# EAGLE design BEP3_RPM (EAGLE 6.4)
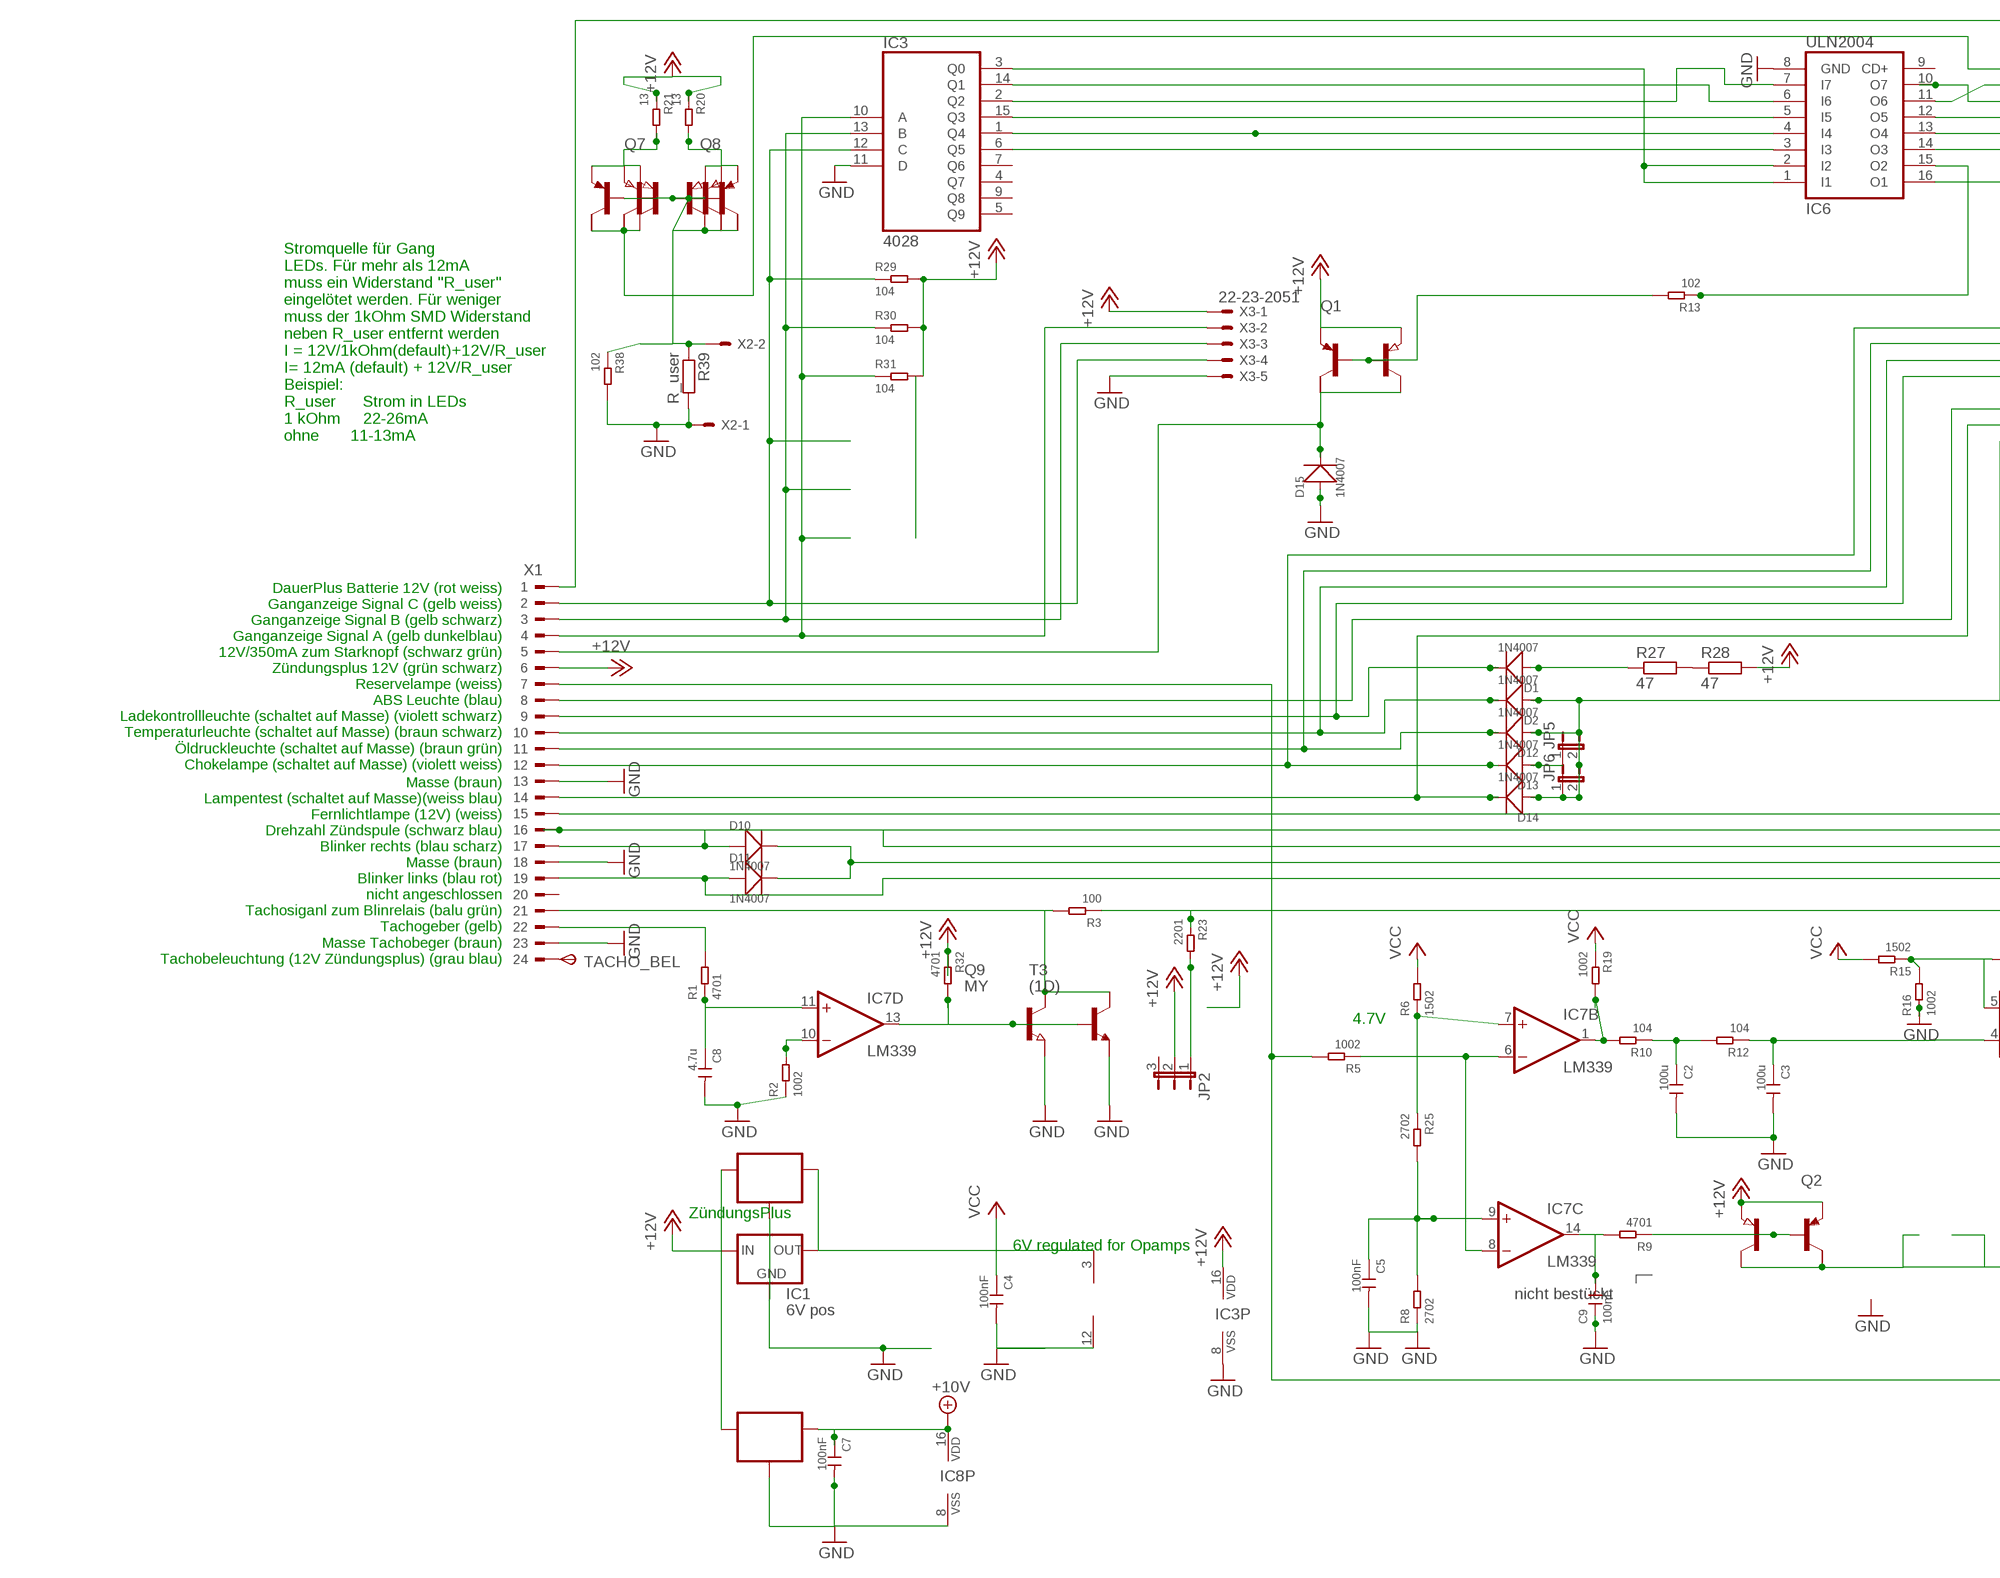
[diagram p0: schematic, sheet 1, part 1 of 2]
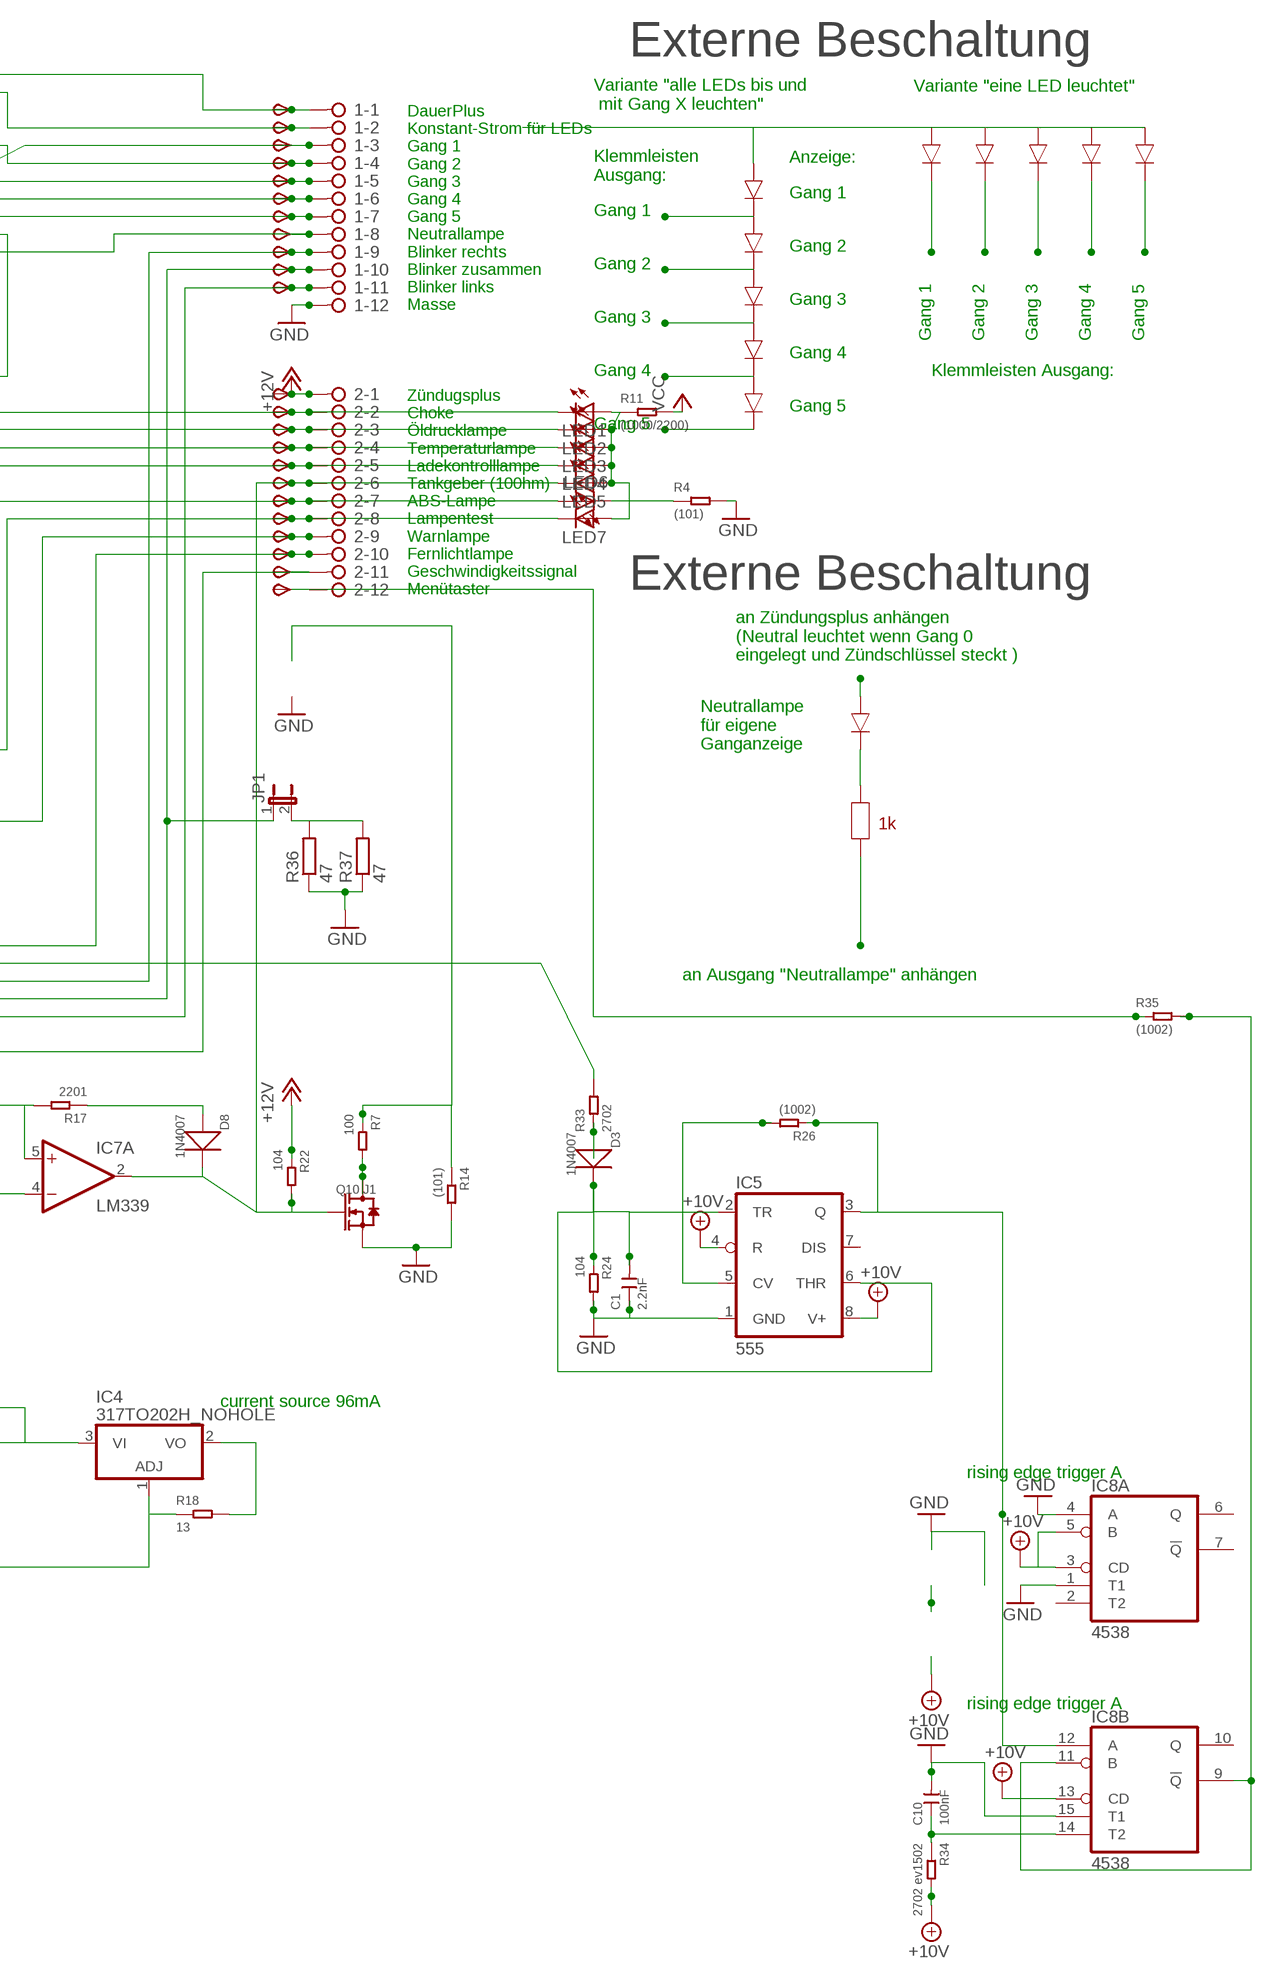
[diagram p1: schematic, sheet 1, part 2 of 2]

## Parts
1  2081-1132  [12-PIN]
2  2081-1132  [12-PIN]
C1  2.2nF  CERAMIC-100NF-50V-10%-X7R(0805)  [C0805]
C2  100u  CERAMIC-100UF-6.3V-20%-X5R(1206)  [C1206]
C3  100u  CERAMIC-100UF-6.3V-20%-X5R(1206)  [C1206]
C4  100nF  CERAMIC-100NF-50V-10%-X7R(0805)  [C0805]
C5  100nF  CERAMIC-100NF-50V-10%-X7R(0805)  [C0805]
C7  100nF  CERAMIC-100NF-50V-10%-X7R(0805)  [C0805]
C8  4.7u  CERAMIC-4.7UF-25V-10%-X5R(0805)  [C0805]
C9  100nF  CERAMIC-100NF-50V-10%-X7R(0805)  [C0805]
C10  100nF  CERAMIC-100NF-50V-10%-X7R(0805)  [C0805]
D1  1N4007  DIODE-GEN-PURPOSE-1KV-1A(DO-214AC)  [DO-214AC]
D2  1N4007  DIODE-GEN-PURPOSE-1KV-1A(DO-214AC)DO-214AC/1206  [DO-214AC-1206MOUNT]
D3  1N4007  DIODE-GEN-PURPOSE-1KV-1A(DO-214AC)  [DO-214AC]
D8  1N4007  DIODE-GEN-PURPOSE-1KV-1A(DO-214AC)DO-214AC/1206  [DO-214AC-1206MOUNT]
D10  1N4007  DIODE-GEN-PURPOSE-1KV-1A(DO-214AC)  [DO-214AC]
D11  1N4007  DIODE-GEN-PURPOSE-1KV-1A(DO-214AC)  [DO-214AC]
D12  1N4007  DIODE-GEN-PURPOSE-1KV-1A(DO-214AC)DO-214AC/1206  [DO-214AC-1206MOUNT]
D13  1N4007  DIODE-GEN-PURPOSE-1KV-1A(DO-214AC)DO-214AC/1206  [DO-214AC-1206MOUNT]
D14  1N4007  DIODE-GEN-PURPOSE-1KV-1A(DO-214AC)DO-214AC/1206  [DO-214AC-1206MOUNT]
D15  1N4007  DIODE-GEN-PURPOSE-1KV-1A(DO-214AC)  [DO-214AC]
IC1  6V pos  78LXX  [78LXX]
IC2  78LXX-SOT89  [SOT89]
IC3  4028  4028D  [SO16]
IC4  317TO202H_NOHOLE  [TO220H_NOHOLE]
IC5  555  NE555D  [SO08]
IC6  ULN2004  ULN2004AD  [SO16]
IC7  LM339  LM339D  [SO14]
IC8  4538  4538D  [SO16]
IC9  78LXX-SOT89  [SOT89]
JP1  JP1E  [JP1]
JP2  JP2E  [JP2]
JP5  JP1E  [JP1]
JP6  JP1E  [JP1]
LED1  LEDLD260  [LD260]
LED2  LEDLD260  [LD260]
LED3  LEDLD260  [LD260]
LED4  LEDLD260  [LD260]
LED5  LEDLD260  [LD260]
LED6  LEDLD260  [LD260]
LED7  LEDLD260  [LD260]
Q1  PNP-TRANSISTOR_SOT89  [SOT89]
Q2  PNP-TRANSISTOR_SOT89  [SOT89]
Q3  AH-16  BCP53T1  [SOT223]
Q4  (AH-16)  BCP53T1  [SOT223]
Q5  (AH-16)  BCP53T1  [SOT223]
Q6  (AH-16)  BCP53T1  [SOT223]
Q7  PNP-TRANSISTOR_SOT89  [SOT89]
Q8  PNP-TRANSISTOR_SOT89  [SOT89]
Q9  MY  NPN-TRANSISTOR_SOT89  [SOT89]
Q10  J1  SMD-MOSFET-N-CH-50V-200MA-BSS138W-7-F(SOT-23)  [SOT-23]
R1  4701  SMD-RES-4.7K-5%-1/8W(0805)  [R0805]
R2  1002  SMD-RES-10K-1%-1/8W(0805)  [R0805]
R3  100  SMD-RES-220R-5%-1/8W(0805)  [R0805]
R4  (101)  SMD-RES-100R-5%-1/8W(0805)  [R0805]
R5  1002  SMD-RES-10K-1%-1/8W(0805)  [R0805]
R6  1502  SMD-RES-10K-1%-1/8W(0805)  [R0805]
R7  100  SMD-RES-2.2K-5%-1/8W(0805)  [R0805]
R8  2702  SMD-RES-4.7K-5%-1/8W(0805)  [R0805]
R9  4701  SMD-RES-4.7K-5%-1/8W(0805)  [R0805]
R10  104  SMD-RES-10K-1%-1/8W(0805)  [R0805]
R11  (1000/2200)  SMD-RES-100R-5%-1/8W(0805)  [R0805]
R12  104  SMD-RES-10K-1%-1/8W(0805)  [R0805]
R13  102  SMD-RES-1K-5%-1/8W(0805)  [R0805]
R14  (101)  SMD-RES-2.2K-5%-1/8W(0805)  [R0805]
R15  1502  SMD-RES-10K-1%-1/8W(0805)  [R0805]
R16  1002  SMD-RES-10K-1%-1/8W(0805)  [R0805]
R17  2201  SMD-RES-2.2K-5%-1/8W(0805)  [R0805]
R18  13  SMD-RES-13R-5%-1/4W(1206)  [R1206]
R19  1002  SMD-RES-10K-1%-1/8W(0805)  [R0805]
R20  13  SMD-RES-13R-5%-1/4W(1206)  [R1206]
R21  13  SMD-RES-13R-5%-1/4W(1206)  [R1206]
R22  104  SMD-RES-10K-1%-1/8W(0805)  [R0805]
R23  2201  SMD-RES-2.2K-5%-1/8W(0805)  [R0805]
R24  104  SMD-RES-10K-1%-1/8W(0805)  [R0805]
R25  2702  SMD-RES-4.7K-5%-1/8W(0805)  [R0805]
R26  (1002)  SMD-RES-10K-1%-1/8W(0805)  [R0805]
R27  47  R-EU_V235/17_1MM  [V235/17_1MM]
R28  47  R-EU_V235/17_1MM  [V235/17_1MM]
R29  104  SMD-RES-10K-1%-1/8W(0805)  [R0805]
R30  104  SMD-RES-10K-1%-1/8W(0805)  [R0805]
R31  104  SMD-RES-10K-1%-1/8W(0805)  [R0805]
R32  4701  SMD-RES-4.7K-5%-1/8W(0805)  [R0805]
R33  2702  SMD-RES-10K-1%-1/8W(0805)  [R0805]
R34  2702 ev1502  SMD-RES-4.7K-5%-1/8W(0805)  [R0805]
R35  (1002)  SMD-RES-4.7K-5%-1/8W(0805)  [R0805]
R36  47  R-EU_V235/17_1MM  [V235/17_1MM]
R37  47  R-EU_V235/17_1MM  [V235/17_1MM]
R38  102  SMD-RES-1K-5%-1/8W(0805)  [R0805]
R39  R_user  R-EU_R0805  [R0805]
T1  PNP2SM8  [SM8]
T3  (1D)  MMBTA42LT1-NPN-SOT23-BEC  [SOT23-BEC]
TACHO_BEL  TPSP1_1MM  [P1_1.0MM]
TP1  TPSB1.8  [B1.8]
TP2  TPSB1.8  [B1.8]
TP3  TPSB1.8  [B1.8]
TP4  TPSB1.8  [B1.8]
TP5  TPSB1.8  [B1.8]
TP6  TPSB1.8  [B1.8]
TP7  TPSB1.8  [B1.8]
TP8  TPSB1.8  [B1.8]
TP9  TPSB1.8  [B1.8]
TP10  TPSB1.8  [B1.8]
TP11  TPSB1.8  [B1.8]
TP12  TPSB1.8  [B1.8]
TP13  TPSB1,27  [B1,27]
TP16  TPSB1.8  [B1.8]
TP17  TPSB1.8  [B1.8]
TP18  TPSB1.8  [B1.8]
TP19  TPSB1.8  [B1.8]
TP21  TPSB1.8  [B1.8]
TP22  TPSB1.8  [B1.8]
TP23  TPSB1.8  [B1.8]
TP24  TPSB1,27  [B1,27]
TP25  TPSB1.8  [B1.8]
TP26  TPSB1.8  [B1.8]
X1  CON_BMWV2  [24-PIN_V2]
X2  22-23-2021  [22-23-2021]
X3  22-23-2051  [22-23-2051]

## Nets
+10V: C7.1 IC5.4(R) IC5.8(V+) IC8.3(A:CD) IC8.5(A:B) IC8.13(B:CD) IC8.16(P:VDD) IC9.1(OUT) R34.2
+12V: 2.1 IC1.IN IC2.3(IN) IC3.16(VDD) IC9.3(IN) JP2.2 Q1.3(E) Q2.3(E) Q3.3(E) Q4.3(E) R20.1 R21.1 R22.1 R28.2 R29.2 R30.2 R31.2 R32.1 TP12.TP(PP) X1.6 X3.1
GND: 1.12 C1.1 C2.2 C3.2 C4.2 C5.2 C7.2 C8.2 C9.1 C10.2 D15.1(+) IC1.GND IC2.2(GND) IC2.4(GND) IC3.8(VSS) IC3.11(D) IC5.1(GND) IC6.8(GND) IC7.12(P:GND) IC8.1(A:T1) IC8.4(A:A) IC8.8(P:VSS) IC8.15(B:T1) Q9.3(E) Q10.2(S) R2.1 R4.2 R8.1 R14.2 R16.1 R24.2 R36.1 R37.1 R38.2 R39.2 T3.E X1.13 X1.18 X1.23 X2.1 X3.5
N$1: 2.9 D2.1(+) D12.1(+) D14.1(+) JP5.2 JP6.1 JP6.2 TP24.TP(PP)
N$2: IC3.10(A) R31.1 X1.4 X3.2
N$3: IC3.13(B) R30.1 X1.3 X3.3
N$4: 2.7 LED6.A TP22.TP(PP) X1.8
N$5: Q5.3(E) Q8.3(E) R21.2 T1.1(B:E)
N$7: IC7.10(D:-IN) R2.2
N$8: R27.2 R28.1
N$9: Q6.3(E) Q7.3(E) R20.2 T1.3(A:E)
N$11: D15.2(-) Q1.2(C) Q3.2(C) X1.5
N$12: 2.2 D13.2(-) LED1.K(C) TP16.TP(PP) X1.12
N$13: 2.3 D12.2(-) LED2.K(C) TP17.TP(PP) X1.11
N$14: 2.4 D2.2(-) LED3.K(C) TP18.TP(PP) X1.10
N$15: IC4.3(VI) Q2.2(C) Q4.2(C)
N$16: IC7.6(B:-IN) IC7.8(C:-IN) R5.1
N$17: IC3.12(C) R29.1 X1.2 X3.4
N$18: IC3.15(Q3) IC6.5(I5)
N$19: 2.8 D14.2(-) LED7.K(C) TP23.TP(PP) X1.14
N$20: 1.9 D10.1(+) TP9.TP(PP) X1.17
N$21: 1.11 D11.1(+) TP11.TP(PP) X1.19
N$22: IC8.9(B:!Q) IC8.11(B:B) R35.2
N$23: R1.2 X1.22
N$24: C8.1 IC7.11(D:+IN) R1.1
N$25: 1.6 IC6.13(O4) TP6.TP(PP)
N$26: 1.7 IC6.14(O3) TP7.TP(PP)
N$27: 2.11 R3.1 R23.1 TP26.TP(PP)
N$28: R7.1 R14.1
N$29: JP2.1 R23.2
N$30: C5.1 IC7.9(C:+IN) R8.2 R25.2
N$31: C9.2 IC7.14(C:OUT) R9.2
N$32: C1.2 D3.2(-) IC5.2(TR) IC5.6(THR) R24.1
N$34: LED6.K(C) R4.1
N$35: IC4.1(ADJ) R5.2 R18.1 X1.7
N$36: Q2.1(B) Q4.1(B) R9.1
N$37: IC3.2(Q2) IC6.7(I7)
N$38: 1.3 IC6.11(O6) TP3.TP(PP)
N$39: 1.5 IC6.12(O5) TP5.TP(PP)
N$41: LED1.A LED2.A LED3.A LED4.A LED5.A LED7.A R11.1
N$42: R33.2 X1.16
N$43: Q1.1(B) Q3.1(B) R13.2
N$44: IC3.3(Q0) IC6.1(I1) IC6.2(I2)
N$45: C2.1 R10.1 R12.2
N$46: C3.1 IC7.4(A:-IN) R12.1
N$47: IC7.5(A:+IN) R15.1 R16.2 R17.2
N$48: Q10.3(D) R7.2
N$49: D8.1(+) R17.1
N$50: IC3.1(Q4) IC6.4(I4)
N$52: 1.8 IC6.16(O1) TP8.TP(PP)
N$53: 2.10 TP25.TP(PP) X1.15
N$54: D1.1(+) R27.1
N$55: 2.5 D1.2(-) LED4.K(C) TP19.TP(PP) X1.9
N$56: IC3.14(Q1) IC6.6(I6)
N$57: Q5.1(B) Q6.1(B) Q6.2(C) Q7.1(B) Q7.2(C) Q8.1(B) R38.1 R39.1 T1.2(B:B) T1.4(A:B) T1.6(A:C1) X2.2
N$58: TACHO_BEL.TP(PP) X1.24
N$59: 1.2 Q5.2(C) Q8.2(C) T1.8(B:C1) TP2.TP(PP)
N$60: 2.6 D8.2(-) IC7.2(A:OUT) LED5.K(C) Q10.1(G) R22.2 TP21.TP(PP)
N$61: IC3.6(Q5) IC6.3(I3)
N$64: IC4.2(VO) R18.2
N$65: IC5.5(CV) R26.2
N$67: 1.4 IC6.10(O7) TP4.TP(PP)
N$69: 1.1 TP1.TP(PP) X1.1
N$83: IC7.7(B:+IN) R6.1 R25.1
N$84: Q9.2(C) R3.2 T3.C X1.21
N$85: IC7.13(D:OUT) Q9.1(B) R32.2 T3.B
N$86: IC5.3(Q) IC8.12(B:A) R26.1
N$87: D3.1(+) R33.1
N$88: IC6.15(O2) R13.1
N$89: C10.1 IC8.14(B:T2) R34.1
N$90: 2.12 R35.1 TP13.TP(PP)
N$93: 1.10 D10.2(-) D11.2(-) JP1.1 TP10.TP(PP)
N$94: JP1.2 R36.2 R37.2
N$95: D13.1(+) JP5.1
N$580: IC7.1(B:OUT) R10.2 R19.2
VCC: C4.1 IC1.OUT IC2.1(OUT) IC7.3(P:V+) R6.2 R11.2 R15.2 R19.1
Unconnected: IC3.4(Q7) IC3.5(Q9) IC3.7(Q6) IC3.9(Q8) IC5.7(DIS) IC6.9(CD+) IC8.2(A:T2) IC8.6(A:Q) IC8.7(A:!Q) IC8.10(B:Q) IC9.2(GND) IC9.4(GND) JP2.3 Q3.4(C/) Q4.4(C/) Q5.4(C/) Q6.4(C/) T1.5(A:C) T1.7(B:C) X1.20

## Notes on the sheet
- Externe Beschaltung
- Variante "eine LED leuchtet"
- Variante "alle LEDs bis und
   mit Gang X leuchten"
- Anzeige:
- Klemmleisten
  Ausgang:
- Gang 1
- DauerPlus
  Konstant-Strom für LEDs
  Gang 1
  Gang 2
  Gang 3
  Gang 4
  Gang 5
  Neutrallampe
  Blinker rechts
  Blinker zusammen
  Blinker links
  Masse
- Gang 1
- Gang 2
- Gang 2
- Gang 3
- Gang 3
- Gang 1 | Gang 2 | Gang 3 | Gang 4 | Gang 5
- Gang 4
- Gang 4 | Klemmleisten Ausgang:
- Gang 5
- Gang 5
- Zündugsplus
  Choke
  Öldrucklampe
  Temperaturlampe
  Ladekontrolllampe
  Tankgeber (100hm)
  ABS-Lampe
  Lampentest
  Warnlampe
  Fernlichtlampe
  Geschwindigkeitssignal
  Menütaster
- Stromquelle für Gang
  LEDs. Für mehr als 12mA
  muss ein Widerstand "R_user"
  eingelötet werden. Für weniger
  muss der 1kOhm SMD Widerstand
  neben R_user entfernt werden
  I = 12V/1kOhm(default)+12V/R_user
  I= 12mA (default) + 12V/R_user
  Beispiel:
  R_user      Strom in LEDs
  1 kOhm     22-26mA
  ohne       11-13mA
- Externe Beschaltung
- an Zündungsplus anhängen
  (Neutral leuchtet wenn Gang 0
  eingelegt und Zündschlüssel steckt )
- Neutrallampe
  für eigene
  Ganganzeige
- DauerPlus Batterie 12V (rot weiss)
  Ganganzeige Signal C (gelb weiss)
  Ganganzeige Signal B (gelb schwarz)
  Ganganzeige Signal A (gelb dunkelblau)
  12V/350mA zum Starknopf (schwarz grün)
  Zündungsplus 12V (grün schwarz)
  Reservelampe (weiss)
  ABS Leuchte (blau)
  Ladekontrollleuchte (schaltet auf Masse) (violett schwarz)
  Temperaturleuchte (schaltet auf Masse) (braun schwarz)
  Öldruckleuchte (schaltet auf Masse) (braun grün)
  Chokelampe (schaltet auf Masse) (violett weiss)
- 1k
- an Ausgang "Neutrallampe" anhängen
- Masse (braun)
  Lampentest (schaltet auf Masse)(weiss blau)
  Fernlichtlampe (12V) (weiss)
  Drehzahl Zündspule (schwarz blau)
  Blinker rechts (blau scharz)
  Masse (braun)
  Blinker links (blau rot)
  nicht angeschlossen
  Tachosiganl zum Blinrelais (balu grün)
  Tachogeber (gelb)
  Masse Tachobeger (braun)
  Tachobeleuchtung (12V Zündungsplus) (grau blau)
- 4.7V
- ZündungsPlus
- current source 96mA
- 6V regulated for Opamps
- nicht bestückt | rising edge trigger A
- rising edge trigger A

## Library data of the parts
1 2 = con WAGO BMW:2081-1132: WAGO SREW CLAMP
C1 C4 C5 C7 C9 C10 = Seeed-Capacitor-2016:CERAMIC-100NF-50V-10%-X7R(0805): 302010165; MPN: CC0805KRX7R9BB104; VALUE: 100nf
C2 C3 = Seeed-Capacitor-2016:CERAMIC-100UF-6.3V-20%-X5R(1206): 302010183; MPN: GRM31CR60J107ME39L; VALUE: 100uf
C8 = Seeed-Capacitor-2016:CERAMIC-4.7UF-25V-10%-X5R(0805): 302010146; MPN: CC0805KKX5R8BB475; VALUE: 4.7uf
D1 D3 D10 D11 D15 = Diode-do214ac:DIODE-GEN-PURPOSE-1KV-1A(DO-214AC): 304010013; MPN: 1N4007
D2 D8 D12-D14 = Diode-do214ac:DIODE-GEN-PURPOSE-1KV-1A(DO-214AC): 304010013
IC1 = v-reg:78LXX: VOLTAGE REGULATOR
IC2 IC9 = 78LXX:78LXX
IC3 = 4028:4028: BCD to decimal DECODER
IC4 = linear_BMW:*317: Positive VOLTAGE REGULATOR
IC5 = linear:*555: TIMER
IC6 = uln-udn:ULN2004A: DRIVER ARRAY
IC7 = LM339:LM339: Low Power Low Offset Voltage Quad Comparators with open collector; LM139/LM239/LM339/LM2901/LM3302
IC8 = 45xx:4538: Dual precision monostable MULTIVIBRATOR
JP1 JP5 JP6 = jumper:JP1E: JUMPER
JP2 = jumper:JP2E: JUMPER
LED1-LED7 = led:LED: LED OSRAM: - CHIPLED LG R971, LG N971, LY N971, LG Q971, LY Q971, LO R971, LY R971 LH N974, LH R974 LS Q976, LO Q976, LY Q976 LO Q996 - Hyper CHIPLED LW Q18S LB Q993, LB Q99A, LB R99A - SideLED LS A670, LO A670, LY A670, LG A670, LP A670 LB A673, LV A673, LT A673, LW A673 LH A674 LY A675 LS A676, LA A676, LO A676, LY A676, LW A676 LS A679, LY A679, LG A679 - Hyper Micro SIDELED® LS Y876, LA Y876, LO Y876, LY Y876 LT Y87S - SmartLED LW L88C, LW L88S LB L89C, LB L89S, LG L890 LS L89K, LO L89K, LY L89K LS L896, LA L896, LO L896, LY L896 - TOPLED LS T670, LO T670, LY T670, LG T670, LP T670 LSG T670, LSP T670, LSY T670, LOP T670, LYG T670 LG T671, LOG T671, LSG T671 LB T673, LV T673, LT T673, LW T673 LH T674 LS T676, LA T676, LO T676, LY T676, LB T676, LH T676, LSB T676, LW T676 LB T67C, LV T67C, LT T67C, LS T67K, LO T67K, LY T67K, LW E67C LS E67B, LA E67B, LO E67B, LY E67B, LB E67C, LV E67C, LT E67C LW T67C LS T679, LY T679, LG T679 LS T770, LO T770, LY T770, LG T770, LP T770 LB T773, LV T773, LT T773, LW T773 LH T774 LS E675, LA E675, LY E675, LS T675 LS T776, LA T776, LO T776, LY T776, LB T776 LHGB T686 LT T68C, LB T68C - Hyper Mini TOPLED® LB M676 - Mini TOPLED Santana® LG M470 LS M47K, LO M47K, LY M47K Source: http://www.osram.convergy.de LUXEON: - LUMILED® LXK2-PW12-R00, LXK2-PW12-S00, LXK2-PW14-U00, LXK2-PW14-V00 LXK2-PM12-R00, LXK2-PM12-S00, LXK2-PM14-U00 LXK2-PE12-Q00, LXK2-PE12-R00, LXK2-PE12-S00, LXK2-PE14-T00, LXK2-PE14-U00 LXK2-PB12-K00, LXK2-PB12-L00, LXK2-PB12-M00, LXK2-PB14-N00, LXK2-PB14-P00, LXK2-PB14-Q00 LXK2-PR12-L00, LXK2-PR12-M00, LXK2-PR14-Q00, LXK2-PR14-R00 LXK2-PD12-Q00, LXK2-PD12-R00, LXK2-PD12-S00 LXK2-PH12-R00, LXK2-PH12-S00 LXK2-PL12-P00, LXK2-PL12-Q00, LXK2-PL12-R00 Source: www.luxeon.com KINGBRIGHT: KA-3528ASYC Source: www.kingbright.com
Q1 Q2 Q7 Q8 = Transistor_SOT89:PNP-TRANSISTOR_: PNP TRANSISTOR
Q3-Q6 = BCP53_:BCP53*
Q9 = Transistor_SOT89:NPN-TRANSISTOR_: NPN TRANSISTOR
Q10 = Seeed-Transistor-2016:SMD-MOSFET-N-CH-50V-200MA-BSS138W-7-F(SOT-23): 305030000; MPN: BSS138W-7-F; VALUE: BSS138W-7-F
R1 R8 R9 R25 R32 R34 R35 = Seeed-Resistor-2016:SMD-RES-4.7K-5%-1/8W(0805): 301010306; MPN: RC0805JR-074K7L; VALUE: 4.7K
R2 R5 R6 R10 R12 R15 R16 R19 R22 R24 R26 R29-R31 R33 = Seeed-Resistor-2016:SMD-RES-10K-1%-1/8W(0805): 301010361; MPN: RC0805FR-0710KL; VALUE: 10K
R3 = Seeed-Resistor-2016:SMD-RES-220R-5%-1/8W(0805): 301010315; MPN: RC0805JR-07220RL; VALUE: 220R
R4 R11 = Seeed-Resistor-2016:SMD-RES-100R-5%-1/8W(0805): 301010319; MPN: RC0805JR-07100RL; VALUE: 100R
R7 R14 R17 R23 = Seeed-Resistor-2016:SMD-RES-2.2K-5%-1/8W(0805): 301010333; MPN: RC0805JR-072K2L; VALUE: 2.2K
R13 R38 = Seeed-Resistor-2016:SMD-RES-1K-5%-1/8W(0805): 301010311; MPN: RC0805JR-071KL; VALUE: 1K
R18 R20 R21 = Seeed-Resistor-2016:SMD-RES-13R-5%-1/4W(1206): 301010405; MPN: RC1206JR-0713RL; VALUE: 13R
R27 R28 R36 R37 R39 = rcl:R-EU_: RESISTOR, European symbol
T1 = PNP2SM8:PNP2SM8; OC_FARNELL: unknown; OC_NEWARK: unknown
T3 = transistor:*-NPN-: NPN Transistror BF959 corrected 2008.03.06
TACHO_BEL TP1-TP13 TP16-TP19 TP21-TP26 = testpin_BMW:TPS: TEST PIN
X1 = con_BMW:CON_BMW: BMW CONNECTOR
X2 = con_Molex_BMW:22-23-2021: .100" (2.54mm) Center Header - 2 Pin; MF: MOLEX; MPN: 22-23-2021; OC_FARNELL: 1462926; OC_NEWARK: 25C3832
X3 = con_Molex_BMW:22-23-2051: .100" (2.54mm) Center Header - 5 Pin; MF: MOLEX; MPN: 22-23-2051; OC_FARNELL: 1462952; OC_NEWARK: 38C9178

## Board
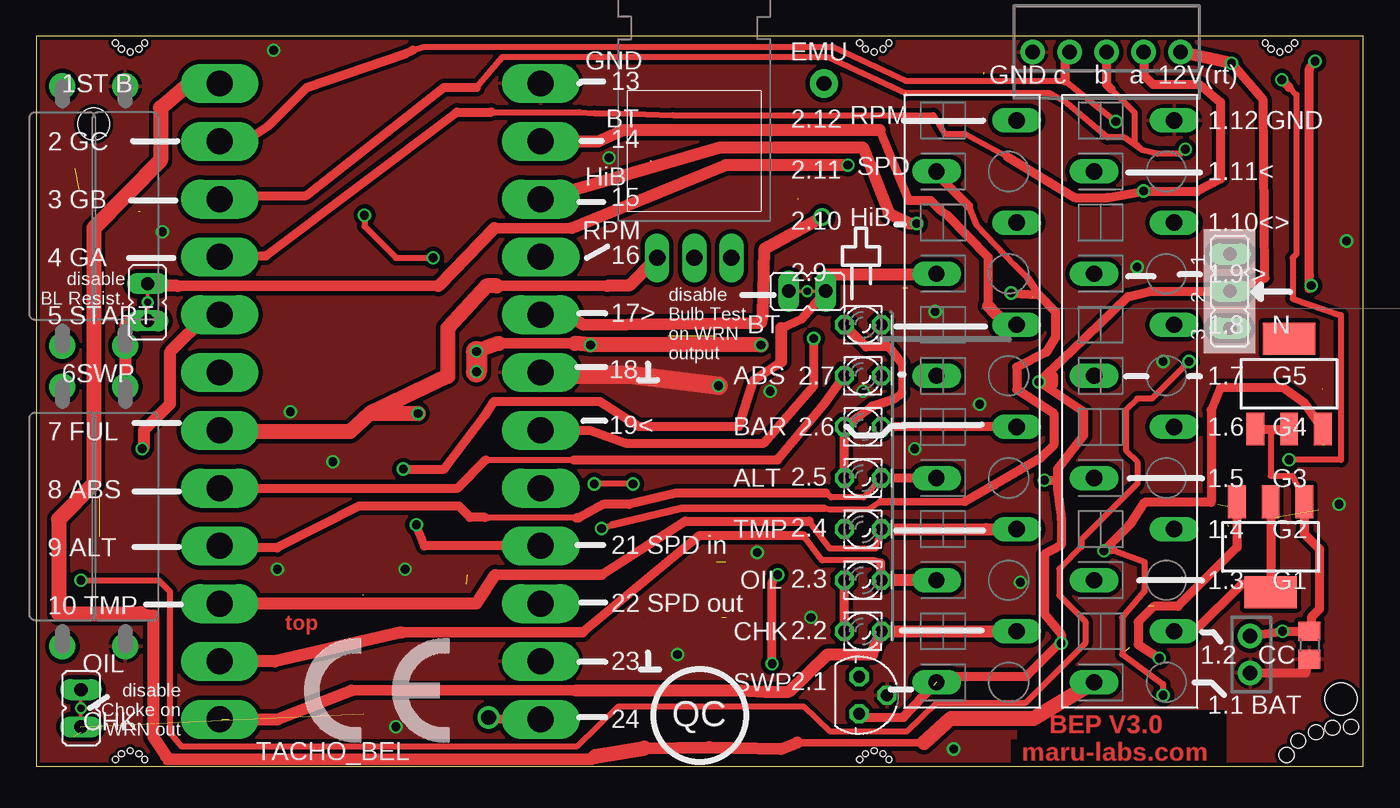
[diagram p2: board, top side]
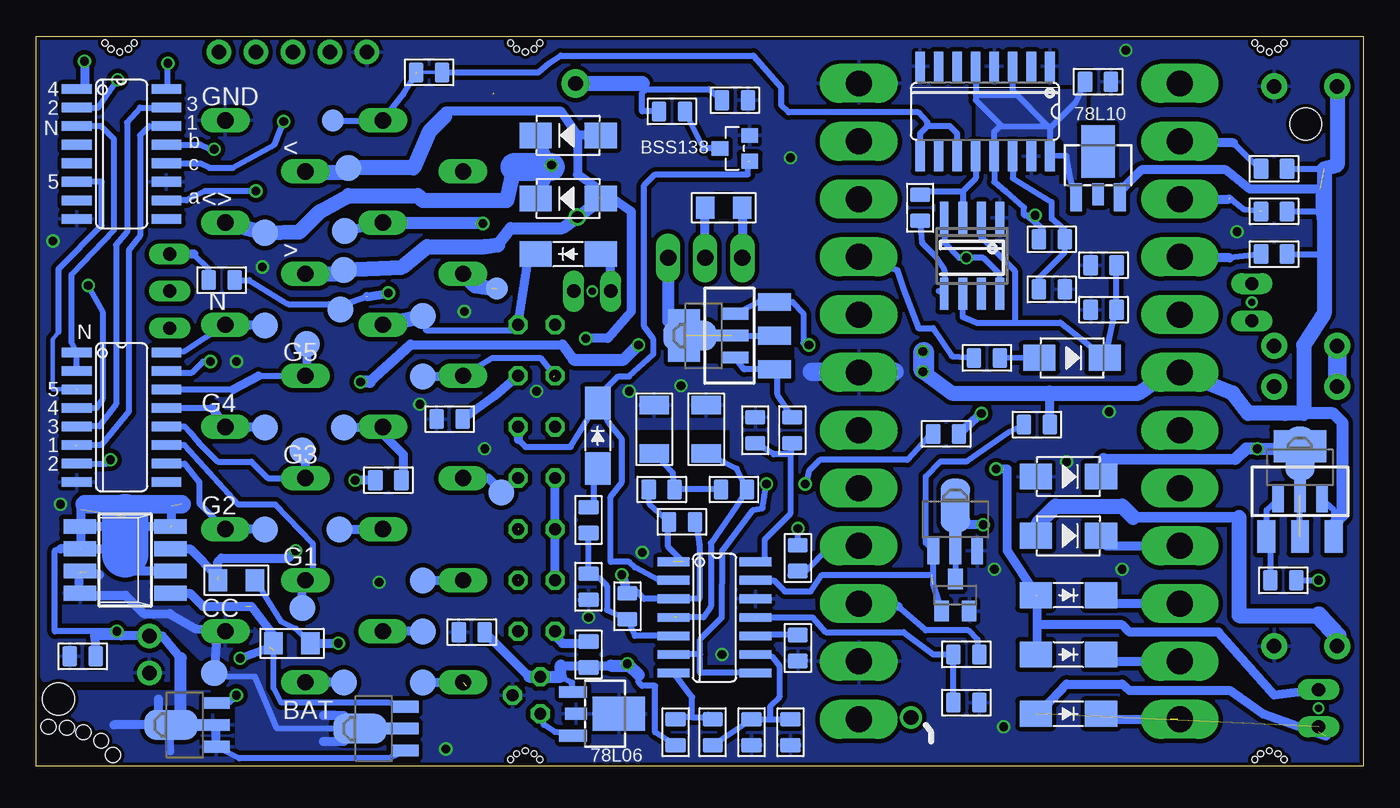
[diagram p3: board, bottom side, seen from below]

Size 90.92 x 50 mm. Coordinates in mm from the lower left corner, seen from the top.
Outline: 0,0 90.92,0 90.92,50 0,50 0,0
Copper layers (1*16): Top 0.035mm / dielectric 1.5mm / Bottom 0.035mm
Design rules "SeeedStudio_2layer_DRU_no_angle_20140221 *": minimum track width 6mil, minimum drill 12mil, track to track 12mil, track to pad 12mil, pad to pad 6mil, via to via 6mil, smd to smd 0mil, copper to edge 10mil, drill to drill 10mil, minimum pad ring 10mil, minimum via ring 6mil, stop-mask expansion 2mil, vias tented up to drill 100mil, thermal gap 10mil
Holes 1.02 mm at 90.11,2.71 88.84,2.64 87.69,2.33 86.49,1.75 85.68,0.77
Holes 2.18 mm at 89.42,4.6 3.92,44
Holes 0.4 mm at 57.42,1.06 56.82,0.86 56.42,0.46 58.02,0.86 58.42,0.46 6.42,1.06 5.82,0.86 5.42,0.46 7.02,0.86 7.42,0.46 6.42,48.94 7.02,49.14 7.42,49.54 5.82,49.14 5.42,49.54 57.42,48.94 58.02,49.14 58.42,49.54 56.82,49.14 56.42,49.54 85.22,48.94 85.82,49.14 86.22,49.54 84.62,49.14 84.22,49.54
tRestrict: area 71.3,0.3 to 81.5,3.8; area 66.8,0.3 to 71.4,1.8
bRestrict: area 39,27.9 to 41.8,29; area 44.1,27.6 to 45.3,29.1; area 45.5,28.7 to 46.2,30.4; area 43.2,37.4 to 44.5,39.4; area 43.4,19.7 to 49.9,23; area 27.6,10.2 to 28.2,11.1

### Footprints (pad centres in the part's own frame; a part is rotated, then mirrored left to right if it is on the bottom)
12-PIN = drill 1.118 long: 1 19.25,-2.45; 2 15.75,3.05; 3 12.25,-2.45; 4 8.75,3.05; 5 5.25,-2.45; 6 1.75,3.05; 7 -1.75,-2.45; 8 -5.25,3.05; 9 -8.75,-2.45; 10 -12.25,3.05; 11 -15.75,-2.45; 12 -19.25,3.05
C0805 = smd 1.397 x 1.016: 1 0,0.889; 2 0,-0.889
C1206 = smd 1.27 x 2.032: 1 -1.651,0; 2 1.651,0
DO-214AC = smd 2.2 x 1.77: 1 -2.242,0; 2 2.242,0
DO-214AC-1206MOUNT = smd 2.2 x 1.77: 1 -2.242,0; 2 2.242,0
78LXX = drill 0.813 octagon: GND 0,1.905; IN 1.27,0; OUT -1.27,0
SOT89 = smd 0.8 x 1.9: 1 -1.5,-1.95; 3 1.5,-1.95 | smd 0.8 x 1.5: 2 0,-1.75 | smd 2.3 x 3.6: 4 0,1.2
SO16 = smd 0.66 x 2.032: 1 -4.445,-3.073; 2 -3.175,-3.073; 3 -1.905,-3.073; 4 -0.635,-3.073; 5 0.635,-3.073; 6 1.905,-3.073; 7 3.175,-3.073; 8 4.445,-3.073; 9 4.445,3.073; 10 3.175,3.073; 11 1.905,3.073; 12 0.635,3.073; 13 -0.635,3.073; 14 -1.905,3.073; 15 -3.175,3.073; 16 -4.445,3.073
TO220H_NOHOLE = drill 1.118 long: 1 -2.54,-10.16; 2 0,-10.16; 3 2.54,-10.16
SO08 = smd 0.6 x 2.2: 1 -1.905,-2.6; 2 -0.635,-2.6; 3 0.635,-2.6; 4 1.905,-2.6; 5 1.905,2.6; 6 0.635,2.6; 7 -0.635,2.6; 8 -1.905,2.6
SO14 = smd 0.6 x 2.2: 1 -3.81,-2.8; 2 -2.54,-2.8; 3 -1.27,-2.8; 4 0,-2.8; 5 1.27,-2.8; 6 2.54,-2.8; 7 3.81,-2.8; 8 3.81,2.8; 9 2.54,2.8; 10 1.27,2.8; 11 0,2.8; 12 -1.27,2.8; 13 -2.54,2.8; 14 -3.81,2.8
JP1 = drill 0.914 long: 1 0,-1.27; 2 0,1.27
JP2 = drill 0.914 long: 1 -2.54,0; 2 0,0; 3 2.54,0
LD260 = drill 0.813 octagon: A -1.27,0; K 1.27,0
SOT89' = smd 0.8 x 1.8: 1 -1.499,-2.181; 3 1.499,-2.181 | smd 0.8 x 2.3: 2 0,-1.927 | smd 2.032 x 3.65: 2@1 0,0.94
SOT223 = smd 1.219 x 2.235: 1 -2.311,-3.099; 2 0,-3.099; 3 2.311,-3.099 | smd 3.6 x 2.2: 4 0,3.099
SOT-23 = smd 1.016 x 1.143: 1 -0.889,-1.016; 2 0.889,-1.016; 3 0,1.016
R0805 = smd 1.397 x 1.016: 1 0,0.889; 2 0,-0.889
R1206 = smd 1.27 x 1.524: 1 -1.27,0; 2 1.27,0
V235/17_1MM = drill 1 pad 1.778: 1 -8.89,0; 2 8.89,0
R0805' = smd 1.3 x 1.5: 1 -0.95,0; 2 0.95,0
SM8 = smd 1.016 x 2.235: 1 -2.286,-3.099; 2 -0.762,-3.099; 3 0.762,-3.099; 4 2.286,-3.099; 5 2.286,3.099; 6 0.762,3.099; 7 -0.762,3.099; 8 -2.286,3.099
SOT23-BEC = smd 1 x 1.4: B -0.95,-1.1; C 0,1.1; E 0.95,-1.1
P1_1.0MM = drill 1.016: TP 0,0
B1.8 = smd 1.8 x 1.8: TP 0,0
B1,27 = smd 1.5 x 1.5: TP 0,0
24-PIN_V2 = drill 1.778 long: 1 -21.78,-11; 2 -17.82,-11; 3 -13.86,-11; 4 -9.9,-11; 5 -5.94,-11; 6 -1.98,-11; 7 1.98,-11; 8 5.94,-11; 9 9.9,-11; 10 13.86,-11; 11 17.82,-11; 12 21.78,-11; 13 -21.78,11; 14 -17.82,11; 15 -13.86,11; 16 -9.9,11; 17 -5.94,11; 18 -1.98,11; 19 1.98,11; 20 5.94,11; 21 9.9,11; 22 13.86,11; 23 17.82,11; 24 21.78,11
22-23-2021 = drill 1 pad 1.676: 1 -1.27,0; 2 1.27,0
22-23-2051 = drill 1 pad 1.676: 1 -5.08,0; 2 -2.54,0; 3 0,0; 4 2.54,0; 5 5.08,0

### Placement (x,y rotation side)
1  74.93,25 270 top
2  64.14,25 270 top
C1  17.78,31.28 90 bottom
C2  48.58,23.09 90 bottom
C3  45.02,23.09 90 bottom
C4  61.09,9.18 270 bottom
C5  41.91,2.33 0 bottom
C7  18.16,46.9 90 bottom
C8  27.18,4.36 90 bottom
C9  41.66,23.03 0 bottom
C10  21.34,32.68 90 bottom
D1  20.19,15.79 0 bottom
D2  20.19,11.72 0 bottom
D3  19.94,27.98 0 bottom
D8  52.45,22.65 90 bottom
D10  54.48,38.9 180 bottom
D11  54.48,43.22 180 bottom
D12  20.19,7.66 0 bottom
D13  20.19,3.6 0 bottom
D14  54.48,35.09 180 bottom
D15  20.19,19.85 0 bottom
IC1  56.39,4.87 270 top
IC2  52.2,3.6 270 bottom
IC3  85.09,41.95 270 bottom
IC4  45.09,45 0 top
IC5  26.8,34.97 180 bottom
IC6  85.09,23.92 270 bottom
IC7  44.45,10.2 270 bottom
IC8  25.91,44.87 180 bottom
IC9  18.16,40.93 0 bottom
JP1  7.62,31.79 180 top
JP2  81.79,32.55 270 top
JP5  3.05,3.98 0 top
JP6  52.83,32.55 90 top
LED1  56.64,9.25 0 top
LED2  56.64,12.75 0 top
LED3  56.64,16.25 0 top
LED4  56.64,19.75 0 top
LED5  56.64,23.25 0 top
LED6  56.64,26.75 0 top
LED7  56.64,30.25 0 top
Q1  [SOT89']  4.32,20.49 0 bottom
Q2  [SOT89']  45.21,29.5 90 bottom
Q3  4.32,18.84 0 bottom
Q4  43.43,29.5 90 bottom
Q5  84.58,15.03 180 top
Q6  85.85,26.2 0 top
Q7  [SOT89']  80.77,2.83 90 bottom
Q8  [SOT89']  67.82,2.58 90 bottom
Q9  MY  [SOT89']  27.94,16.93 0 bottom
Q10  43.05,42.33 90 bottom
R1  27.18,7.66 90 bottom
R2  38.73,8.1 180 bottom
R3  38.73,14.26 0 bottom
R4  62.61,23.79 270 bottom
R5  28.58,22.77 90 bottom
R6  47.12,2.33 0 bottom
R7  47.37,44.87 90 bottom
R8  39.24,2.33 180 bottom
R9  39.12,23.03 0 bottom
R10  48.07,18.96 270 bottom
R11  53.09,7.66 0 bottom
R12  43.12,18.96 270 bottom
R13  5.46,12.74 270 bottom
R14  43.05,45.63 90 bottom
R15  50.42,10.96 180 bottom
R16  53.09,12.3 180 bottom
R17  53.09,16.87 0 bottom
R18  43.82,38.27 180 bottom
R19  46.67,16.74 270 bottom
R20  77.22,12.74 180 bottom
R21  73.41,8.42 180 bottom
R22  66.8,19.6 90 bottom
R23  78.23,33.31 270 bottom
R24  17.78,34.33 270 bottom
R25  44.58,2.33 0 bottom
R26  30.35,38.27 0 bottom
R27  1.78,17.12 90 top
R28  1.78,37.7 90 top
R29  6.1,40.93 90 bottom
R30  6.1,38.01 90 bottom
R31  6.1,35.09 90 bottom
R32  22.35,23.41 270 bottom
R33  25.78,27.98 270 bottom
R34  21.34,36.11 270 bottom
R35  64.01,47.54 90 bottom
R36  6.1,17.12 90 top
R37  6.1,37.7 270 top
R38  87.76,7.53 270 bottom
R39  R_user  [R0805']  87.25,8.29 270 top
T1  84.84,14.14 90 bottom
T3  27.94,11.72 0 bottom
TACHO_BEL  30.99,3.34 0 bottom
TP1  69.85,5.76 0 bottom
TP2  78.74,6.39 0 bottom
TP3  72.71,10.84 0 bottom
TP4  75.25,16.23 0 bottom
TP5  72.71,21.63 0 bottom
TP6  75.25,23.22 0 bottom
TP7  72.39,28.93 0 bottom
TP8  75.25,30.2 0 bottom
TP9  69.85,34.01 0 bottom
TP10  75.25,36.55 0 bottom
TP11  69.53,41 0 bottom
TP12  64.45,5.76 0 bottom
TP13  70.61,44.24 0 bottom
TP16  64.45,9.25 0 bottom
TP17  64.45,12.74 0 bottom
TP18  70.17,16.23 0 bottom
TP19  59.06,18.77 0 bottom
TP21  69.85,23.22 0 bottom
TP22  64.45,26.71 0 bottom
TP23  64.45,30.84 0 bottom
TP24  59.37,32.74 0 bottom
TP25  69.79,36.68 0 bottom
TP26  70.1,31.28 0 bottom
U$1  [CE_10.00]  18.29,1.56 0 top
X1  23.55,25 270 top
X2  83.19,7.66 90 top
X3  73.34,48.94 180 top

### Tracks (layer width: path | path; a pad name or v marks a point on that pad's centre or on a via)
+10V  (via drill 0.6)
  Top 0.406: v22.48,37.76 22.48,37 24.64,34.84 v27.18,34.84
  Bottom 0.406: 21.59,43.85 24,46.27 IC8.3 | 21.46,43.73 IC8.16 20.32,41.82 20.07,40.3 19.81,39.41 19.66,39.01 IC9.1 | 23.24,37.89 21.97,36.87 R34.2 | 24.77,43.85 24.89,43.85 25.27,43.47 IC8.13 25.27,40.05 24.51,39.41 23.24,38.27 23.24,37.89 | 24.77,43.85 21.59,43.85 | 21.59,43.85 21.46,43.73 | IC5.4 28.7,35.85 27.69,34.84 v27.18,34.84 26.03,34.84 24.89,33.7 IC5.8 | C7.1 19.69,45.51 21.46,43.73 | v22.48,37.76 23.24,37.76 23.24,37.89 | IC8.5 26.54,46.01 | 26.54,46.01 26.54,45.63 24.77,43.85 | 26.54,46.01 23.88,46.01
  pour Bottom: 26.54,46.27 19.05,46.27 19.05,40.3 20.45,40.3 20.45,42.84 20.83,43.22 26.42,43.22 26.42,46.14
+12V  (via drill 0.6)  (2 unrouted)
  Top 0.406: IC1.IN 56.64,3.34 | 61.47,5.5 61.44,5.5
  Top 0.61: 69.98,19.6 69.98,20.36 71.75,22.65 71.75,24.3 v68.71,26.33 70.99,28.49 74.8,32.17 76.33,32.55 JP2.2 84.2,33.44 84.07,45.66 v81.92,48.17 | 69.98,19.6 69.98,18.96 70.23,16.93 70.23,15.15 69.09,14.52 69.09,10.45 70.23,9.06 v70.23,8.42 70.1,8.42 67.82,6.14 62.07,6.14 2.1 | 56.64,3.34 59.44,3.34 61.47,5.5 | v37.97,28.87 41.78,28.87 | v69.09,19.6 69.98,19.6
  Top 0.711: 36.89,28.97 31.69,28.97
  Top 0.813: v81.92,48.17 X3.1
  Top 1.016: v49.66,28.87 v37.97,28.87 36.89,28.97 | 31.69,28.97 v30.16,28.42
  Top 1.422: v30.16,28.42 v30.16,27.03
  Bottom 0.406: IC3.16 81.92,46.4 v81.92,48.17 | R20.1 74.17,9.95 73.15,9.44 R21.1 | v37.97,28.87 38.35,29 38.35,31.03 39.09,31.81 Q4.3 41.4,31.81 Q2.3 | IC2.3 55.4,2.35 56.13,2.83 IC1.IN | Q1.3 2.01,17.57 Q3.3 | R31.2 2.67,35.09 | 2.79,37.38 2.79,37.12 | R30.2 2.92,38.01 | R29.2 2.67,40.93
  Bottom 0.61: 2.1 TP12.TP 64.83,6.14 | 65.28,28.87 54.86,28.87 | R21.1 v70.23,8.42 | R32.1 21.46,25.57 | R22.1 v69.09,19.6 | 2.79,36.87 2.79,37.12 2.92,38.01 2.92,39.54 7.75,39.54 9.4,40.86 15.19,40.86 16.38,39.66 16.64,39.66 16.76,39.54 16.76,39.09 IC9.3
  Bottom 0.711: 65.28,28.87 68.07,26.33 | 54.86,28.87 54.1,27.85
  Bottom 0.813: 68.07,26.33 v68.71,26.33 | 54.1,27.85 50.67,27.85 v49.66,28.87 | Q3.3 2.01,16.57 1.4,17.18 1.4,23.54 2.03,24.17 5.33,24.17
  Bottom 1.016: R28.2 1.78,41.19 2.67,40.93 2.67,35.09 2.67,31.03 4.06,28.87 4.06,24.17 5.33,24.17 7.87,24.17 8.91,25.57 X1.6 12.97,27.22 15.37,25.57 21.46,25.57 28.19,25.57 v30.16,27.03
GND  (via drill 0.6)
  Top 0.61: X2.1 87,6.39 R39.2
  Top 1.27: v46.74,26.07 40.64,26.84 35.94,26.84
  Bottom 1.27: 32.13,27.03 37.78,27.03
  other vias: 17.4,24.3 67.44,12.61 75.44,34.2 60.2,21.76 24.64,2.71 53.09,10.2 50.29,25.69 89.28,17.95 89.79,35.98 16.51,13.5 56.64,25.69 43.94,7.66 62.86,1.18 77.22,27.73 49.4,14.64 16.26,49.06 64.64,24.8 61.59,31.16 39.24,41.7 8.64,36.62 20.32,20.87 25.27,13.5
  pour Bottom (rank 3): 0,50.08 90.81,50.08 90.93,6.9 90.42,5.88 81.03,5.88 77.85,5.5 77.85,0.17 0,-0.09
  pour Top: -0.51,50.08 90.81,50.08 90.81,-0.09 -0.51,-0.09
N$1  (via drill 0.5, 0.6)  (3 unrouted)
  Top 0.254: JP5.2 v3.05,3.98 3.05,2.33 | JP6.1 v52.83,32.55 JP6.2
  Top 0.61: v25.15,20.36 27.94,20.36 30.73,24.04 31.37,25.01 38.61,25.01 41.27,23.28 48.13,23.28 49.15,26.46 51.05,27.73 | 51.05,30.01 52.45,30.65 JP6.1
  Top 0.813: 51.05,27.73 51.05,30.01 | JP6.1 54.16,33.7 60.38,33.7 2.9
  Bottom 0.406: 52.7,34.82 52.24,34.82 D14.1
  Bottom 0.61: v25.15,20.36 24.38,20.36 24.38,14.77 22.35,11.72 22.35,9.69 | 22.36,3.46 20.32,5.63 16.51,5.63 16,5.2 9.14,5.2 6.86,3.6 2.54,2.07 | JP5.2 6.1,4.87 9.91,9.18 16,9.18 16.51,9.69 22.35,9.69 | 22.35,9.69 22.35,7.66 D12.1 | JP6.2 51.56,34.41 D14.1
  Bottom 1.016: 59.69,32.74 60.82,32.92 60.86,32.92 2.9
N$2  (via drill 0.6)
  Top 0.406: 31.18,44.82 37.21,44.82 38.23,44.74 39.88,44.74 43.62,44.62 61.47,44.62 62.23,43.35 63.63,43.35 66.55,41.76
  Top 0.61: X1.4 12.77,34.97 15.72,34.97 28.8,44.82 31.18,44.82 | 66.55,41.76 71.18,38.97 73.41,38.97 v75.88,39.41 75.95,39.35 79.5,39.35 81.15,40.24 81.15,45.51 79.69,46.71 76.52,46.71 75.88,47.35 X3.2
  Bottom 0.406: v75.88,39.41 79.38,39.41 80.64,38.77 IC3.10 | R31.1 9.14,34.84
  Bottom 0.61: 9.14,34.84 12.49,34.84 X1.4
N$3  (via drill 0.6)  (3 unrouted)
  Top 0.406: 30.16,46.52 31.94,48.6 54.16,48.6 59.63,46.09 | 59.56,46.14 69.41,46.14 70.67,45.38 73.41,43.09 74.55,43.09 75.79,42.21 | v78.74,42.27 78.42,41.95 76.84,41.95 75.79,42.21 | 73.66,46.4 75.25,44.81 75.25,42.75 75.79,42.21
  Top 0.61: X1.3 12.94,39.09 18.48,39.09 27.94,46.52 30.16,46.52 | X3.3 73.34,46.71 73.66,46.4
  Bottom 0.406: IC3.13 79.69,42.59 79.06,42.27 v78.74,42.27 | 9.14,38.9 8.13,38.14 7.11,38.01
  Bottom 0.61: X1.3 9.19,38.86
N$4  (1 unrouted)
  Top 0.406: 30.8,21 36.83,21
  Top 0.61: X1.8 28.86,19.06 30.8,21 | 36.83,21 50.8,21 53.98,24.8 55.25,26.58 55.44,26.65
  Bottom 0.406: 2.7 59.69,27.98 56.39,27.98 55.41,26.75
  Bottom 0.61: TP22.TP 61.73,26.71 2.7 | 55.41,26.75 LED6.A
N$5  (via drill 0.6)  (2 unrouted)
  Top 0.61: Q5.3 82.27,15 78.23,10.96 76.6,10.96 75.52,9.88 75.52,8.34 v76.96,7.41
  Bottom 0.406: Q8.3 66.8,4.36 74.14,4.36 74.68,5.37 74.68,7.91
  Bottom 0.61: T1.1 80.39,11.85 79.5,10.96 76.2,10.96 74.68,8.93 | v76.96,7.41 74.93,8.17 R21.2
N$7
  Bottom 0.406: R2.2 41.85,8.99 IC7.10
N$8
  Bottom 1.27: R27.2 R28.1
N$9  (via drill 0.6)  (1 unrouted)
  Top 0.406: v73.15,14.77 73.91,14.77 75.95,14.01 75.95,11.98 74.42,10.2 74.42,7.66 77.22,5.63 v77.22,4.87
  Top 0.61: Q6.3 86.89,24.91 85.47,25.95 81.15,25.95 80.52,24.42 80.52,18.07 75.95,18.07 74.93,16.55 v73.15,14.77
  Bottom 0.406: v77.22,4.87 77.72,4.36 Q7.3
  Bottom 0.61: T1.3 80.39,14.9 78.49,12.99 78.49,14.01 78.23,14.26 73.66,14.26 v73.15,14.77
N$10  (1 unrouted)
  Bottom 0.61: 87.88,17.57 87.88,15.03
  Bottom 3.175: 84.84,17.06 84.84,14.52
N$11  (via drill 0.6)  (1 unrouted)
  Top 0.813: X1.5 11.72,30.94 9.14,28.36 9.14,24.8 7.37,23.03 7.37,21.88 v7.24,21.76
  Bottom 0.406: Q3.2 4.32,21.76
  Bottom 0.711: 8.76,21.05 17.78,21.05
  Bottom 0.813: D15.2 17.78,19.6 17.78,21.05 | 4.32,21.76 4.57,21.76 v7.24,21.76 8,21.76 8.76,21.05
N$12  (1 unrouted)
  Top 0.711: 21.59,5.2 36.96,5.2
  Top 0.813: X1.12 12.71,3.21 16.51,3.21 21.59,5.2 | 36.96,5.2 48.26,5.2 49.91,5.12 51.56,5.12 54.23,7.66 57.28,7.66 LED1.K 2.2
  Bottom 0.61: TP16.TP 2.2 | 13.21,3.21 17.76,3.21 17.76,3.41 D13.2
N$13  (1 unrouted)
  Top 0.406: 57.87,13.93 57.4,14.11 53.85,14.11 52.58,15.79
  Top 0.61: 57.87,12.74 57.87,13.93 | 52.58,15.79 45.4,15.79 37.41,9.17
  Top 0.711: 37.41,9.17 25.03,9.17
  Top 0.813: 2.3 57.87,12.74 | 25.03,9.17 16.35,7.18 X1.11
  Bottom 0.61: TP17.TP 2.3 | X1.11 17.79,7.18 17.79,7.16 17.78,7.15 17.78,7.49 D12.2
N$14  (1 unrouted)
  Top 0.406: 52.96,16.8 54.36,14.92 57.53,14.92 57.85,16.23
  Top 0.61: 38.73,13.11 44.45,16.8 52.96,16.8
  Top 0.711: 31.43,13.11 38.73,13.11
  Top 0.813: X1.10 12.72,11.15 30.16,11.15 31.43,13.11 | 57.85,16.23 65.11,16.25 2.4
  Bottom 0.61: TP18.TP 67.2,16.23 2.4 | X1.10 13.2,11.14 13.21,11.15 17.57,11.15 17.57,11.35 D2.2
N$15  (1 unrouted)
  Bottom 0.406: Q2.2 Q4.2
  Bottom 0.813: IC4.3 47.62,30.52 46.61,29.5
N$16  (via drill 0.6)
  Top 0.406: v40.89,19.34 v38.23,19.34
  Bottom 0.406: 45.44,7.66 45.44,6.39 IC7.8 | 45.44,7.66 IC7.6 | 45.44,7.66 45.44,8.7 43.94,10.2 43.92,14.77 41.91,17.44 41.78,17.57 41.15,17.69 v40.89,19.34 | v38.23,19.34 38.1,19.47 37.93,20.29 37.23,21 31.24,21 29.84,22.52 R5.1
N$17  (via drill 0.6)
  Top 0.406: 25.78,49.06 26.54,49.29 54.55,49.29 59.56,46.97 70.48,46.97 v73.98,44.17
  Top 0.61: X1.2 12.79,42.9 14.86,43.16 15.87,43.85 18.54,46.52 25.27,48.81 25.78,49.06 | X3.4 70.48,48.94 70.48,46.97
  Bottom 0.406: IC3.12 79.69,41.31 79.06,41 77.47,41 74.61,42.59 v73.98,44.17 | R29.1 7.62,41.44 8.89,42.71
  Bottom 0.61: 8.89,42.71 12.45,42.71 X1.2
N$18
  Bottom 0.406: IC3.15 83.82,45.12 84.71,44.11 84.71,36.62 85.47,35.73 85.47,24.8 86.61,23.28 IC6.5
N$19
  Top 0.61: 57.79,43.6 59.75,38.77 61.28,38.77 61.91,38.14 62.42,37.76 65.21,34.9 65.21,31.54 | 66.19,30.52 2.8
  Top 0.813: X1.14 38.5,42.82 40.26,43.6 57.79,43.6 | 65.21,31.54 66.19,30.52
  Bottom 0.406: 64.31,30.69 64.22,29.88 58.1,29.88 58.1,30.06 LED7.K | 57.28,34.48 56.73,34.73 D14.2
  Bottom 0.61: LED7.K 57.28,34.48
  Bottom 1.016: 2.8 TP23.TP 64.31,30.69
N$20  (via drill 0.81)  (1 unrouted)
  Top 0.813: X1.17 36.66,30.81 37.47,30.27 49.66,30.39 49.78,30.9 49.91,35.47 v53.85,37.63
  Bottom 0.813: 59.31,35.73 58.42,36.87 54.86,36.87 v53.85,37.63 52.2,38.88
  Bottom 1.016: 1.9 70.11,33.75 TP9.TP 65.86,34.19 64.14,35.6 60.2,35.6 59.31,35.73
N$21  (via drill 0.6)
  Top 0.61: X1.19 37.9,23.02 40.39,22.14 49.85,22.14 53.28,26.07 v53.28,29.31
  Bottom 0.61: 62.93,44.55 62.93,44.87 54.95,44.87 53.85,43.22 | 53.85,43.22 53.85,40.55 50.16,38.01 50.16,31.16 51.75,29.31 v53.28,29.31 | D11.1 53.85,43.22
  Bottom 1.016: 62.93,44.55 64.01,43.47 65.09,41 TP11.TP 69.85,40.68 71.72,40.68 1.11
N$22
  Bottom 0.406: IC8.11 27.81,43.35 28.32,43.85 29.84,43.85 | 29.84,43.85 30.35,43.35 IC8.9 | 29.84,43.85 29.84,44.11 30.48,44.8 39.37,44.8 39.88,45.3 39.88,46.52 41.78,48.68 54.99,48.68 55.74,48.19 56.52,47.54 R35.2
N$23
  Bottom 0.406: R1.2 26.42,8.68 27.05,9.31 29.97,9.31 31.88,10.96
  Bottom 0.61: 31.88,10.96 34.41,10.96 X1.22
N$24  (1 unrouted)
  Bottom 0.406: IC7.11 37.72,10.2 36.83,9.18 31.5,9.18 29.46,7.66 R1.1 C8.1
N$25
  Bottom 0.406: IC6.13 78.87,24.55
  Bottom 0.61: TP6.TP 77.95,23.22 1.6 78.87,24.55
N$26
  Bottom 0.406: 75.7,26.75 1.7 | IC6.14 77.43,25.82
  Bottom 0.61: TP7.TP 72.39,26.84 1.7 | 77.43,25.82 75.7,26.75
N$27  (via drill 0.6)  (1 unrouted)
  Top 0.406: 67.95,33.44 67.06,34.33 64.39,37.12 63.88,38.39 | 57.85,18.14 57.02,17.59 54.36,17.59 53.98,17.69 | v38.73,16.3 39.5,16.55 39.49,16.56
  Top 0.508: 67.95,33.44 68.71,32.3 | 63.63,18.14 57.85,18.14 | 53.98,17.69 44.2,17.69 39.49,16.56
  Top 0.61: 63.63,18.14 65.66,19.28 68.83,21.12 69.72,22.01 69.72,24.17 67.18,25.82 67.18,27.34 69.22,28.36 69.85,29.38 69.85,31.16 68.71,32.3 v66.8,32.42 | 2.11 61.69,40.59 63.88,38.39
  Bottom 0.406: 68.33,32.17 69.85,31.66 TP26.TP 70.87,31.66 73.66,31.66 76.33,33.31 R23.1 | R3.1 v38.73,16.3
  Bottom 0.61: 68.26,32.17 v66.8,32.42
N$28
  Bottom 0.406: 49.15,46.4 49.4,46.78 49.4,46.14 | 49.15,46.4 44.83,46.4 R14.1 | R7.1 49.4,44.87 49.4,46.14 | 49.4,46.14 49.15,46.4 | 53.59,46.78 54.23,47.03
  Bottom 1.016: 49.4,46.78 53.59,46.78
N$29
  Bottom 0.406: R23.2 79.12,34.08 80.14,35.09
  Bottom 0.61: 80.14,35.09 JP2.1
N$30
  Bottom 0.406: R25.2 C5.1 40.64,3.21 | IC7.9 40.51,7.53 40.01,6.9 40.01,4.74 40.64,4.1 40.64,3.21 | 40.64,3.21 R8.2
N$31
  Bottom 0.406: R9.2 39.24,21.38 | 39.24,21.38 39.24,17.31 41.02,15.53 41.02,14.08 IC7.14 | 39.24,21.38 40.39,21.38 C9.2
N$32
  Bottom 0.406: R24.1 C1.2 17.15,30.6 D3.2 20.74,30.39 23.88,30.39 | IC5.2 26.16,36.23 23.88,33.95 23.88,30.39 | 23.88,30.39 26.54,30.39 27.43,30.77 IC5.6
N$34
  Bottom 0.61: LED6.K 59.54,25.35 R4.1
N$35  (via drill 0.6)
  Top 0.711: 39.12,32.91 31.56,32.91
  Top 0.813: 39.12,32.91 40.64,32.93 IC4.1
  Top 1.016: 31.56,32.91 30.84,32.91 28.19,30.01 28.19,26.71 22.86,24.17 | 22.86,24.17 21.5,22.92 12.8,22.92 X1.7 | 22.86,24.17 v26.16,24.17
  Bottom 0.61: v26.16,24.17 26.04,24.3 R5.2 | R18.1 42.52,36.77 IC4.1
N$36
  Bottom 0.406: R9.1 40.13,25.44 40.13,26.99 Q4.1 42.42,27.19 Q2.1
N$37  (via drill 0.6)
  Top 0.406: 85.85,46.52 86.36,46.01 86.36,35.09 86.11,34.84 86.11,32.04 89.41,30.9 89.41,21 v85.85,21
  Top 0.61: v85.34,47.03 85.85,46.52
  Bottom 0.406: IC3.2 86.68,45.12 v85.34,47.03 | IC6.7 86.11,20.74 v85.85,21
N$38
  Bottom 0.406: 1.3 72.52,12.75 72.01,13.51 72.01,15.28 74.55,17.95 77.09,17.95 80.77,22.01 IC6.11
  Bottom 0.61: TP3.TP 72.71,12.52 1.3
N$39
  Bottom 0.406: 1.5 75.08,19.75 76.19,20.87 78.49,20.87 79.76,22.14 80.39,22.9 80.77,23.28 IC6.12
  Bottom 0.61: 1.5 72.48,21.4 TP5.TP
N$41
  Top 0.508: 59.31,25.57 59.31,27.6
  Top 0.61: LED1.A LED2.A | LED4.A LED5.A 57.28,24.68 58.8,25.19 59.31,25.57 | 59.31,27.6 58.42,28.74 56.88,28.74 LED7.A
  Bottom 0.61: LED1.A 55.37,8.93 54.86,8.42 53.28,8.42 R11.1 | LED2.A LED3.A LED4.A
N$42
  Bottom 0.406: X1.16 31.94,34.01 31.5,32.68 30.48,30.01 29.46,30.01 28.19,28.11 R33.2
N$43
  Bottom 0.406: Q1.1 6.63,17.54 Q3.1 6.35,15.46 R13.2
N$44
  Bottom 0.406: IC6.2 IC6.1 88.52,29.02 88.52,33.7 85.6,36.74 85.6,42.97 86.49,43.85 IC3.3
N$45
  Bottom 0.406: C2.1 47.3,20.08 R10.1 R12.2
N$46  (1 unrouted)
  Bottom 0.406: 46.97,10.2 45.21,10.2 44.7,10.96 44.7,15.28 42.93,17.82 R12.1 42.93,20.39 C3.1
N$47
  Bottom 0.406: R17.2 R16.2 52.32,12.87 51.82,12.36 51.82,10.71 R15.1 49.91,8.93 IC7.5
N$48
  Bottom 0.406: Q10.3 45.21,42.33 R7.2
N$49
  Bottom 0.406: R17.1 52.7,17.82 52.7,20.03 D8.1
N$50  (via drill 0.6)
  Top 0.406: v87.38,32.93 87.18,32.68 87.24,32.73
  Top 0.61: 87.24,32.73 87.25,33.63 87.25,47.79 v87.63,48.3
  Bottom 0.406: IC6.4 86.81,24.55 86.36,25.19 86.36,31.09 v87.38,32.93
  Bottom 0.61: v87.63,48.3 87.63,46.4 IC3.1
N$51
  Top 0.406: 8.89,0.29 38.1,0.29
N$52
  Bottom 0.406: 1.8 78.03,30.2 | IC6.16 80.81,28.42 78.11,30.2
  Bottom 0.61: TP8.TP 77.93,30.2 | 78.11,30.2 77.93,30.2 | 77.93,30.2 1.8
N$53  (via drill 0.6)
  Top 0.813: X1.15 46.86,42.4 56.64,42.4 58.42,37.89 59.82,37.19 v60.33,37.19
  Bottom 0.61: TP25.TP 67.12,37.19
  Bottom 0.813: v60.33,37.19 67.12,37.19 2.10
N$54
  Bottom 0.61: 22.24,16.66 22.24,15.98 D1.1
  Bottom 0.711: 15.75,17.06 8.51,17.06
  Bottom 1.016: 22.24,16.66 21.08,17.82 16.51,17.82 15.75,17.06 | 8.51,17.06 8.51,10.33 3.05,10.33
  Bottom 1.27: 3.05,10.33 1.78,8.93 R27.1
N$55
  Top 0.406: LED4.K 56.7,18.43 54.48,18.43 54.1,18.71 | 36.99,17.03 30.96,17.03 30.73,17.06
  Top 0.61: 2.5 LED4.K | 54.1,18.71 43.84,18.71 40.64,17.95 38.86,17.95 37.18,17.03 36.99,17.03 | X1.9 12.84,14.96 16.51,14.96 22.1,17.82 28.96,17.82 29.72,17.06 30.73,17.06
  Bottom 0.61: TP19.TP 59.06,18.86 59.94,19.75 2.5 | X1.9 17.58,15.1 17.58,15.42 D1.2
N$56  (1 unrouted)
  Bottom 0.406: IC3.14 83.19,43.85 83.82,43.22 83.82,36.36 84.58,35.35 84.58,24.3 86.49,22.01 88.27,22.01
N$57  (via drill 0.6)  (3 unrouted)
  Top 0.406: Q6.2 84.58,23.15 84.58,19.9 86.11,19.9 Q5.1
  Top 0.61: X2.2 v85.41,9.25 87,9.25 | Q6.1 Q6.2 | Q5.1 86.89,15.94 T1.6 87.94,10.76 87.38,10.2 87.38,9.37 R39.1
  Bottom 0.406: v85.41,9.25 89.66,9.25 89.66,14.77 89.28,14.9 | Q8.1 66.8,0.55 77.01,0.55 Q7.1 | 82.3,8.93 X2.2
  Bottom 0.61: T1.2 84.07,13.38 85.6,14.9 | T1.4 84.33,16.42 | X2.2 85.09,8.93 | 85.09,8.93 v85.41,9.25 | 85.09,8.93 86.93,8.93 R38.1 | 85.6,14.9 T1.6 89.28,14.9 | 85.6,14.9 84.33,16.42 | 81.03,7.41 82.3,8.93 | Q7.1 78.59,2.58 Q7.2 | 81.03,2.83 85.6,2.83 | 81.79,1.06 81.79,3.09 | 82.55,2.58 82.55,4.61 | 81.66,16.5 81.66,17.82 | 84.33,16.42 87.88,16.42
  Bottom 0.813: 81.03,2.83 81.03,7.41
  Bottom 1.27: 80.98,17.95 87.63,17.95
  pour Bottom: 77.47,5.12 88.9,5.12 88.9,0.04 77.47,0.04
N$58
  Top 0.61: X1.24 31.37,3.22 TACHO_BEL.TP
N$59  (1 unrouted)
  Top 0.61: Q5.2 84.58,12.49 82.6,12.49 79.51,9.39 78.12,9.39 1.2
  Bottom 0.406: Q8.2 74.42,2.58 75.95,6.14 78.49,6.14 TP2.TP
  Bottom 0.61: TP2.TP 78.61,8.42 78.61,9.05 1.2 80.01,9.44 81.79,10.45 83.57,10.45 84.84,11.72 88.14,11.72 88.01,11.85 | T1.8 88.01,11.85 | 88.01,13.25 88.01,11.85 | 86.61,13.12 87.5,13.38 | 69.85,1.69 71.25,1.69 | 69.85,3.47 71.25,3.47
  pour Bottom: 67.06,3.85 73.91,3.85 75.18,5.12 75.69,14.52 89.41,14.52 89.41,9.44 81.79,9.44 77.72,5.37 77.72,5.12 77.22,4.61 77.22,0.8 67.06,0.8
N$60  (1 unrouted)
  Top 0.61: 2.6 LED5.K
  Bottom 0.406: IC7.2 48.26,12.74 49.91,13.63 50.29,14.01 51.56,14.01 51.56,18.45 50.8,19.47 50.8,22.39 51.64,23.48 D8.2 | 57.91,22.39 57.4,21.88 54.3,21.88 D8.2 | D8.2 52.45,25.31 51.05,26.71 50.29,26.71 48.64,28.23 48.64,29.25 49.28,30.14 49.28,39.79 48.51,40.55 42.16,40.55 42.16,41.44
  Bottom 0.61: TP21.TP 67.22,23.22 | 67.22,23.22 2.6 | LED5.K 57.91,22.39 | 67.22,23.22 67.22,22.81 65.79,21.38 65.79,19.73 R22.2
N$61  (1 unrouted)
  Bottom 0.305: 88.14,25.82 89.79,25.82 89.79,29.25 89.41,29.76
  Bottom 0.406: 89.41,29.76 89.41,34.08 86.44,37.06 86.44,40.05 IC3.6
N$63
  Bottom 1.422: 30.1,27.22 30.1,28.36
N$64
  Bottom 0.61: IC4.2 R18.2
N$65
  Bottom 0.406: 29.08,32.55 IC5.5 28.7,34.02 29.34,34.97 30.23,35.85 R26.2
N$67
  Bottom 0.406: IC6.10 80.77,20.74 79.76,19.47 79.76,18.03 1.4
  Bottom 0.61: TP4.TP 77.96,16.23 1.4
N$69
  Top 0.406: 8.89,0.67 38.29,0.67
  Top 0.508: 52.13,1.63 60.83,1.63
  Top 0.813: 7.11,10.45 8,10.33 8,2.01 8.89,0.67 | 41.66,1.25 46.1,1.31 51.05,1.18 52.13,1.63
  Top 1.016: X1.1 10.41,46.71 8.51,45.12 8.51,41.51 3.94,36.87 3.94,19.34 1.52,16.93 1.52,10.45 7.11,10.45 | 38.29,0.67 41.66,1.25 | 60.83,1.63 62.67,3.28 68.35,3.28 1.1
  Bottom 0.61: TP1.TP 1.1
N$70
  Top 0.813: 69.6,26.71 69.6,26.2
N$83
  Bottom 0.406: 45.97,3.34 45.97,4.74 IC7.7 | 44.89,3.53 R25.1 44.7,3.34 45.97,3.34 | 45.97,3.34 46.99,3.34 R6.1
N$84  (via drill 0.6)
  Top 0.61: X1.21 26.6,15.1 v26.03,16.55
  Bottom 0.406: 39.24,13.12 R3.2 38.23,13.38 36.58,15.03 34.63,15.03 X1.21 | Q9.2 T3.C
  Bottom 0.61: v26.03,16.55 27.94,16.55 Q9.2
N$85  (1 unrouted)
  Bottom 0.406: IC7.13 40.39,12.74 39.62,11.98 37.85,11.98 37.08,13.12 29.54,13.12 | R32.2 24.26,22.9 27.18,20.87 28.96,20.87 29.97,19.85 29.97,15.28 Q9.1 29.46,14.06 29.46,12.47 T3.B
N$86
  Bottom 0.406: R26.1 29.97,39.41 27.43,39.41 | 27.43,39.41 IC5.3 | IC8.12 26.54,40.3 27.43,39.41
N$87
  Bottom 0.406: R33.1 22.86,28.02 D3.1
N$88  (via drill 0.6)
  Top 0.406: v78.99,27.73 76.45,25.19 75.44,25.19 74.68,24.42 74.68,21.63 75.44,20.87 75.44,19.34 71.63,15.53 71.63,15.03 70.1,13.5 70.1,11.72 71.88,9.95 71.88,8.42 67.82,4.36 61.72,4.36 59.69,2.4 54.36,2.4 52.58,4.1 39.88,4.1 37.08,1.39 9.91,1.39 9.14,2.33 9.14,11.98 8.38,12.74 v3.05,12.74
  Bottom 0.406: IC6.15 81.89,26.96 80.26,26.96 79.5,27.73 v78.99,27.73 | R13.1 v3.05,12.74
N$89
  Bottom 0.406: IC8.14 24,40.3 21.34,38.65 21.34,37.51 20.45,36.74 R34.1 | 20.45,35.85 R34.1 | C10.1 22.23,33.44 20.45,35.22 R34.1
N$90  (1 unrouted)
  Bottom 0.254: R35.1 63.37,47.54
  Bottom 0.406: 64.9,47.41 65.79,46.03 2.12 67.19,44.24 TP13.TP
N$91  (via drill 1 pad 1.93)
  other vias: 53.98,46.78
N$93  (via drill 0.6)
  Top 0.711: 36.7,36.87 31.37,36.87 | 27.56,32.91 9.65,32.91
  Top 0.813: v55.63,41.19 47.24,41.19 36.7,36.87 | 31.37,36.87 27.56,32.91 | 9.65,32.91 8.23,32.91 JP1.1
  Bottom 0.813: D11.2 55.67,41.06 D10.2 56.64,38.9 v55.63,41.19
  Bottom 1.016: 1.10 TP10.TP 72.9,36.62 71.51,38.01 69.53,39.09 64.77,39.09 64.45,38.77 58.67,38.77 58.17,41.06
  Bottom 1.93: 58.17,41.06 55.67,41.06
N$94  (via drill 0.5)
  Top 0.254: JP1.2 v7.62,31.79 7.62,32.81
  Top 0.813: R36.2 6.1,27.47 R37.2 6.1,30.27 6.35,30.52 JP1.2
N$95  (1 unrouted)
N$580  (1 unrouted)
  Bottom 0.406: 46.61,14.01 47.62,15.03 47.62,16.23 R19.2 48.89,17.95 R10.2
VCC  (via drill 0.6)
  Top 0.61: v50.42,7.03 50.42,12.61 v50.8,13.12
  Bottom 0.406: R19.1 45.66,16.23 45.49,15.15 45.49,11.47 IC7.3 49.28,11.47 49.78,11.98 49.85,11.98 R15.2 | R6.2 48.51,2.33 48.51,5.5 49.4,5.5 49.65,5.75 49.65,6.26 | IC2.1 54.2,5.73 54.99,6.14
  Bottom 0.61: v50.8,13.12 R15.2 | 54.99,6.9 53.09,6.9 | 53.09,6.9 51.56,6.9 | C4.1 57.15,6.14 | R11.2 53.09,6.9
  Bottom 0.813: 54.99,6.9 54.99,6.14 IC1.OUT 57.15,6.14 | 51.56,6.9 50.29,6.9 | 50.29,6.9 v50.42,7.03 | 49.65,6.26 50.29,6.9

### Text on the board
Top: top | BEP V3.0 / maru-labs.com
tPlace: QC
bPlace: 4 | 3 | 2 | 1 | b | c | 5 | a | 5 | 4 | 3 | 1 | 2
tNames: EMU | GND c b a 12V(rt) | GND / BT / HiB | RPM | RPM / SPD / HiB | disable / BL Resist. | disable / Bulb Test / on WRN / output | 18 | 19< | 2.7 / 2.6 | 1.12 GND / 1.11< / 1.10<> / 1.9 > / 1.8 N / 1.7 G5 / 1.6 G4 / 1.5 G3 / 1.4 G2 / 1.3 G1 | 1.2 CC | disable / Choke on / WRN out | BT / ABS / BAR / ALT / TMP / OIL / CHK / SWP | 1.1 BAT | 1ST B / 2 GC / 3 GB / 4 GA / 5 START / 6SWP / 7 FUL / 8 ABS / 9 ALT / 10 TMP / OIL / CHK | 2.12 / 2.11 / 2.10 / 2.9 / / / / 2.5 / 2.4 / 2.3 / 2.2 / 2.1 | 13 / 14 / 15 / 16 / 17> / / / / 21 SPD in / 22 SPD out / 23 / 24
bNames: 78L10 | N | BSS138 | N | < / / > / / G5 / / G3 / / G1 / / / BAT | GND / / <> / / N / / G4 / / G2 / / CC | 78L06
tValues: set jumper for / motoscope tiny / support
bValues: BA | BA | 6,8 | 2.4V(off)/1.1V(on) | 4 | 13 GND / 14 BT / 15 HiB / 16 RPM / 17 > / 18 GND / 19 < / / 21 SPD in / 22 SPD o / 23 GND | 6V | SPD / / WRN / / ABS / / ALT / / OIL / / SWP | RPM / / HiB / / BT / / RES / / TMP / / CHK | 4.7V | BA | BA | 1 BAT / 2 GC / 3 GB / 4 GA / 5 START / 6 SWP / 7R ES / 8A BS / 9 / 10 TMP / 11 OIL / 12CH K
tStop: BEP V3.0 / maru-labs.com
tDocu: +12v